# EAGLE design DataControlBoard-Teensy (EAGLE 9.4.2)

## Sheet 1 of 2
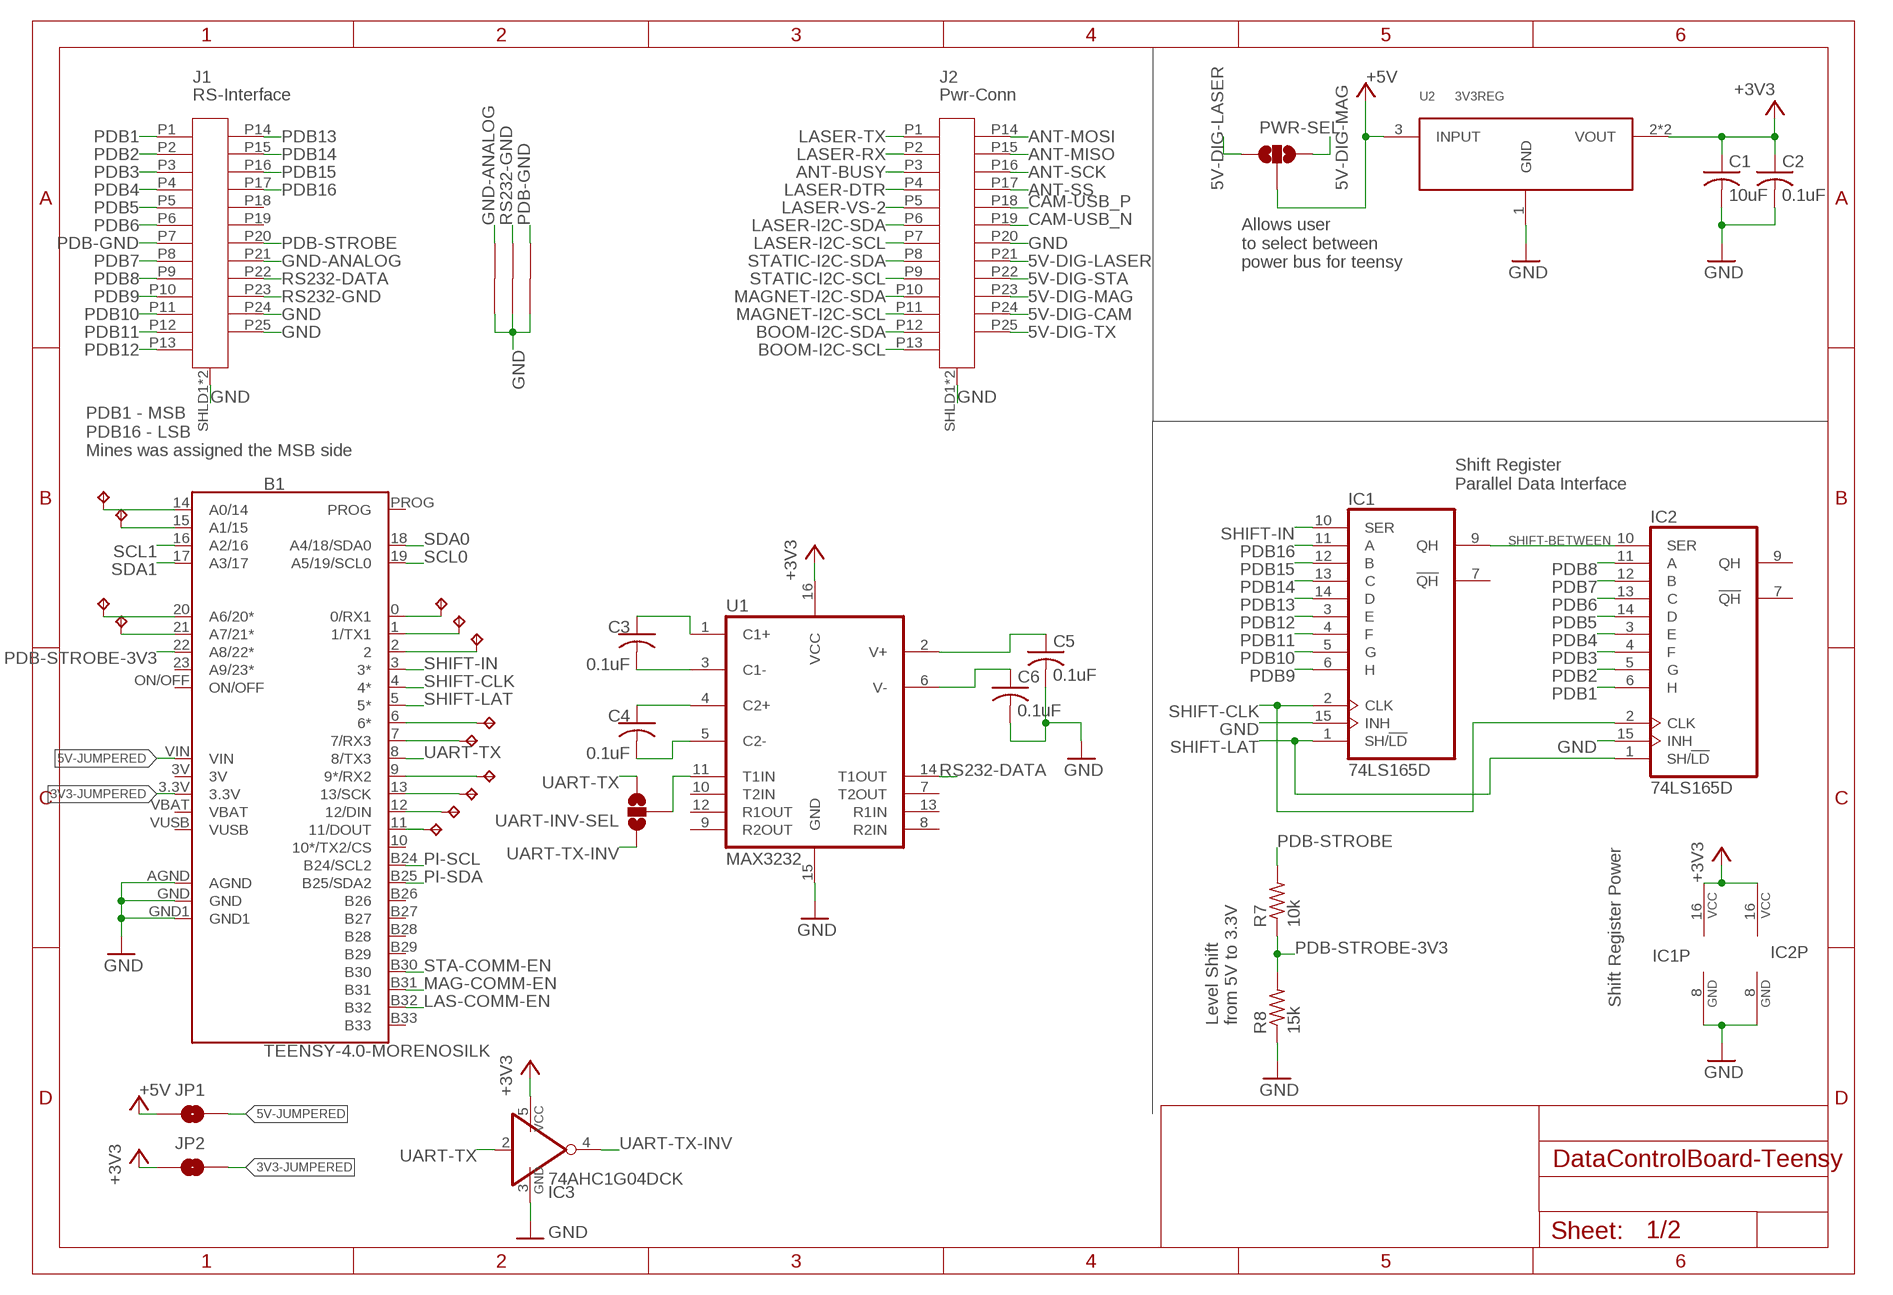
[diagram p0: schematic, sheet 1]

### Parts
B1  TEENSY-4.0-MORENOSILK  [TEENSY-4.0_NOSILK]
C1  10uF  C-USC0805  [C0805]
C2  0.1uF  C-USC0805  [C0805]
C3  0.1uF  C-USC0805  [C0805]
C4  0.1uF  C-USC0805  [C0805]
C5  0.1uF  C-USC0805  [C0805]
C6  0.1uF  C-USC0805  [C0805]
IC1  74LS165D  [SO16]
IC2  74LS165D  [SO16]
IC3  74AHC1G04DCK  [SC70-5]
J1  RS-Interface  MICRO-D25  [MICRO-D25-RA]
J2  Pwr-Conn  MICRO-D25  [MICRO-D25-RA]
JP1  JUMPER-SMT_2_NO_NO-SILK  [SMT-JUMPER_2_NO_NO-SILK]
JP2  JUMPER-SMT_2_NO_NO-SILK  [SMT-JUMPER_2_NO_NO-SILK]
PWR-SEL  JUMPER-SMT_3_NO_NO-SILK  [SMT-JUMPER_3_NO_NO-SILK]
R7  10k  R-US_R0805  [R0805]
R8  15k  R-US_R0805  [R0805]
TP8  TPPAD1-13  [P1-13]
TP9  TPPAD1-13  [P1-13]
TP10  TPPAD1-13  [P1-13]
TP11  TPPAD1-13  [P1-13]
TP12  TPPAD1-13  [P1-13]
TP13  TPPAD1-13  [P1-13]
TP14  TPPAD1-13  [P1-13]
TP15  TPPAD1-13  [P1-13]
TP16  TPPAD1-13  [P1-13]
TP17  TPPAD1-13  [P1-13]
TP18  TPPAD1-13  [P1-13]
TP19  TPPAD1-13  [P1-13]
TP20  TPPAD1-13  [P1-13]
U1  MAX3232  MAX2323SOIC16  [SO16]
U2  3V3REG  [SOT223]
U$1  GND-MERGER  [GND-MERGER]
U$2  GND-MERGER  [GND-MERGER]
U$3  GND-MERGER  [GND-MERGER]
UART-INV-SEL  JUMPER-SMT_3_NO_NO-SILK  [SMT-JUMPER_3_NO_NO-SILK]

### Nets
3V3-JUMPERED: B1.3.3V JP2.2
5V-DIG-CAM: J2.P24 ; also sheet 2
5V-DIG-LASER: J2.P21 PWR-SEL.1 ; also sheet 2
5V-DIG-MAG: J2.P23 PWR-SEL.3 ; also sheet 2
5V-DIG-STA: J2.P22 ; also sheet 2
5V-DIG-TX: J2.P25 ; also sheet 2
5V-JUMPERED: B1.VIN JP1.2
+3V3: C1.1 C2.1 IC1.16(VCC) IC2.16(VCC) IC3.5(VCC) JP2.1 U1.16(VCC) U2.2(VOUT) U2.4(VOUT) ; also sheet 2
+5V: JP1.1 PWR-SEL.2 U2.3(INPUT) ; also sheet 2
ANT-BUSY: J2.P3 ; also sheet 2
ANT-MISO: J2.P15 ; also sheet 2
ANT-MOSI: J2.P14 ; also sheet 2
ANT-SCK: J2.P16 ; also sheet 2
ANT-SS: J2.P17 ; also sheet 2
BOOM-I2C-SCL: J2.P13 ; also sheet 2
BOOM-I2C-SDA: J2.P12 ; also sheet 2
CAM-USB_N [USB-Diff]: J2.P19 ; also sheet 2
CAM-USB_P [USB-Diff]: J2.P18 ; also sheet 2
GND: B1.AGND B1.GND B1.GND1 C1.2 C2.2 C5.2 C6.2 IC1.8(GND) IC1.15(INH) IC2.8(GND) IC2.15(INH) IC3.3(GND) J1.P24 J1.P25 J1.SHLD1(SHLD) J1.SHLD2(SHLD) J2.P20 J2.SHLD1(SHLD) J2.SHLD2(SHLD) R8.1 U1.15(GND) U2.1(GND) U$1.P$1 U$2.P$1 U$3.P$1 ; also sheet 2
GND-ANALOG: J1.P21 U$1.P$2
LAS-COMM-EN: B1.B32 ; also sheet 2
LASER-DTR: J2.P4 ; also sheet 2
LASER-I2C-SCL: J2.P7 ; also sheet 2
LASER-I2C-SDA: J2.P6 ; also sheet 2
LASER-RX: J2.P2 ; also sheet 2
LASER-TX: J2.P1 ; also sheet 2
LASER-VS-2: J2.P5 ; also sheet 2
MAG-COMM-EN: B1.B31 ; also sheet 2
MAGNET-I2C-SCL: J2.P11 ; also sheet 2
MAGNET-I2C-SDA: J2.P10 ; also sheet 2
N$1: B1.0(0/RX1) TP12.TP
N$2: B1.1(1/TX1) TP13.TP
N$3: B1.2 TP14.TP
N$4: B1.9(9*/RX2) TP15.TP
N$5: B1.13(13/SCK) TP16.TP
N$7: B1.12(12/DIN) TP17.TP
N$8: B1.11(11/DOUT) TP18.TP
N$9: B1.14(A0/14) TP8.TP
N$10: B1.15(A1/15) TP9.TP
N$11: B1.20(A6/20*) TP10.TP
N$12: B1.21(A7/21*) TP11.TP
N$13: B1.6(6*) TP19.TP
N$14: B1.7(7/RX3) TP20.TP
N$20: U1.11(T1IN) UART-INV-SEL.2
N$32: C5.1 U1.2(V+)
N$33: C6.1 U1.6(V-)
N$34: C3.1 U1.1(C1+)
N$35: C3.2 U1.3(C1-)
N$36: C4.1 U1.4(C2+)
N$37: C4.2 U1.5(C2-)
PDB1: IC2.6(H) J1.P1
PDB2: IC2.5(G) J1.P2
PDB3: IC2.4(F) J1.P3
PDB4: IC2.3(E) J1.P4
PDB5: IC2.14(D) J1.P5
PDB6: IC2.13(C) J1.P6
PDB7: IC2.12(B) J1.P8
PDB8: IC2.11(A) J1.P9
PDB9: IC1.6(H) J1.P10
PDB10: IC1.5(G) J1.P11
PDB11: IC1.4(F) J1.P12
PDB12: IC1.3(E) J1.P13
PDB13: IC1.14(D) J1.P14
PDB14: IC1.13(C) J1.P15
PDB15: IC1.12(B) J1.P16
PDB16: IC1.11(A) J1.P17
PDB-GND: J1.P7 U$3.P$2
PDB-STROBE: J1.P20 R7.2 ; also sheet 2
PDB-STROBE-3V3: B1.22(A8/22*) R7.1 R8.2
PI-SCL: B1.B24(B24/SCL2) ; also sheet 2
PI-SDA: B1.B25(B25/SDA2) ; also sheet 2
RS232-DATA: J1.P22 U1.14(T1OUT)
RS232-GND: J1.P23 U$2.P$2
SCL0: B1.19(A5/19/SCL0) ; also sheet 2
SCL1: B1.16(A2/16) ; also sheet 2
SDA0: B1.18(A4/18/SDA0) ; also sheet 2
SDA1: B1.17(A3/17) ; also sheet 2
SHIFT-BETWEEN: IC1.9(QH) IC2.10(SER)
SHIFT-CLK: B1.4(4*) IC1.2(CLK) IC2.2(CLK)
SHIFT-IN: B1.3(3*) IC1.10(SER)
SHIFT-LAT: B1.5(5*) IC1.1(SH/!LD) IC2.1(SH/!LD)
STA-COMM-EN: B1.B30 ; also sheet 2
STATIC-I2C-SCL: J2.P9 ; also sheet 2
STATIC-I2C-SDA: J2.P8 ; also sheet 2
UART-TX: B1.8(8/TX3) IC3.2(I) UART-INV-SEL.3
UART-TX-INV: IC3.4(O) UART-INV-SEL.1
Unconnected: B1.10(10*/TX2/CS) B1.23(A9/23*) B1.B26 B1.B27 B1.B28 B1.B29 B1.B33 B1.ON/OFF B1.PROG IC1.7(!QH) IC2.7(!QH) IC2.9(QH) J1.P18 J1.P19 U1.7(T2OUT) U1.8(R2IN) U1.9(R2OUT) U1.10(T2IN) U1.12(R1OUT) U1.13(R1IN)

### Notes on the sheet
- Allows user
  to select between
  power bus for teensy
- PDB1 - MSB
  PDB16 - LSB 
  Mines was assigned the MSB side
- Shift Register
  Parallel Data Interface
- Shift Register Power
- Level Shift
  from 5V to 3.3V

## Sheet 2 of 2
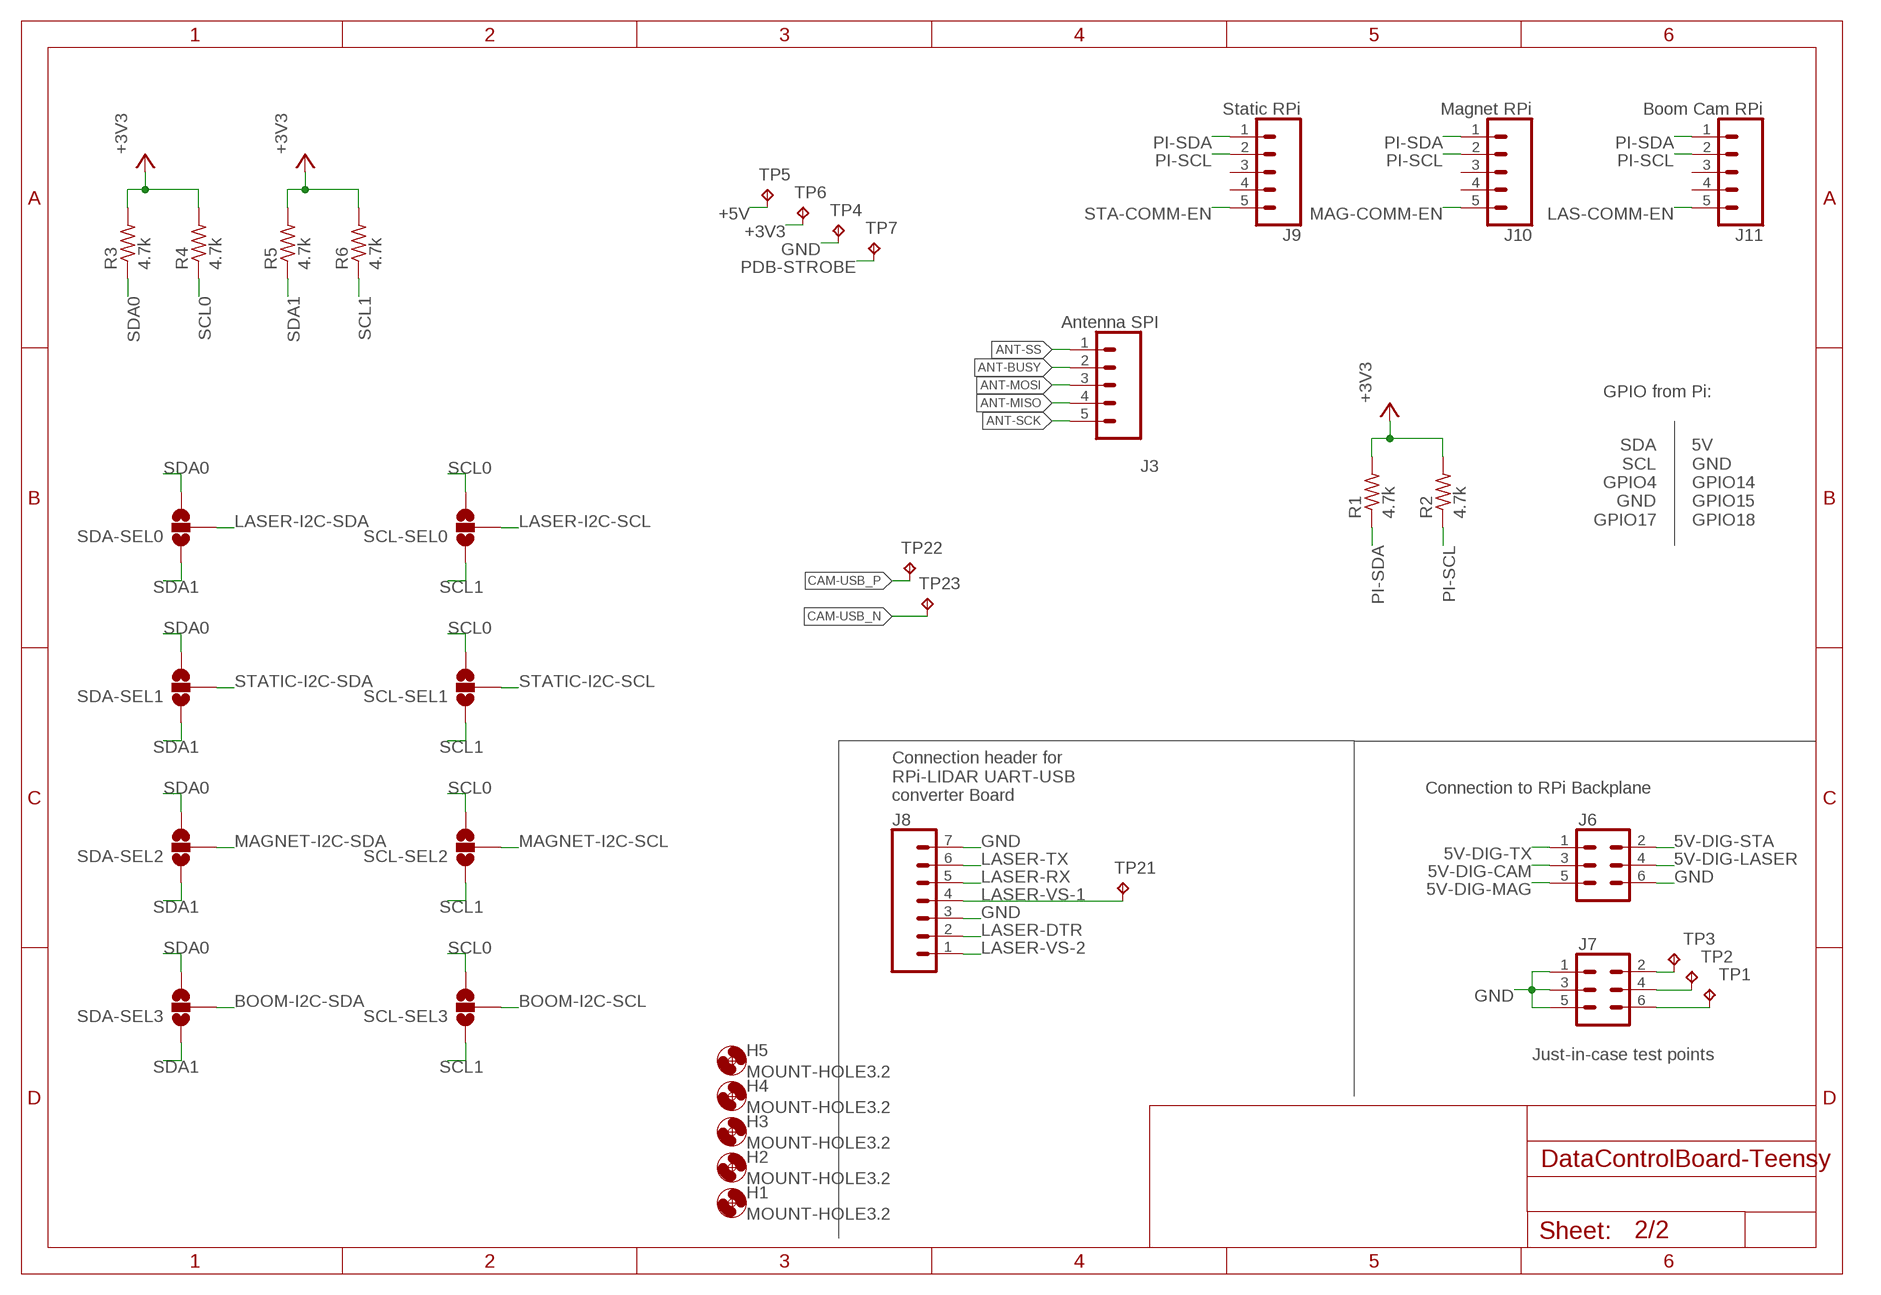
[diagram p1: schematic, sheet 2]

### Parts
H1  MOUNT-HOLE3.2  [3,2]
H2  MOUNT-HOLE3.2  [3,2]
H3  MOUNT-HOLE3.2  [3,2]
H4  MOUNT-HOLE3.2  [3,2]
H5  MOUNT-HOLE3.2  [3,2]
J3  Antenna SPI  CONN_05LOCK  [1X05_LOCK]
J6  CONN_03X22X3_SILK_MALE_PTH  [2X3]
J7  CONN_03X22X3_SILK_MALE_PTH  [2X3]
J8  CONN_07  [1X07]
J9  Static RPi  CONN_05LOCK  [1X05_LOCK]
J10  Magnet RPi  CONN_05LOCK  [1X05_LOCK]
J11  Boom Cam RPi  CONN_05LOCK  [1X05_LOCK]
R1  4.7k  R-US_R0805  [R0805]
R2  4.7k  R-US_R0805  [R0805]
R3  4.7k  R-US_R0805  [R0805]
R4  4.7k  R-US_R0805  [R0805]
R5  4.7k  R-US_R0805  [R0805]
R6  4.7k  R-US_R0805  [R0805]
SCL-SEL0  JUMPER-SMT_3_NO_NO-SILK  [SMT-JUMPER_3_NO_NO-SILK]
SCL-SEL1  JUMPER-SMT_3_NO_NO-SILK  [SMT-JUMPER_3_NO_NO-SILK]
SCL-SEL2  JUMPER-SMT_3_NO_NO-SILK  [SMT-JUMPER_3_NO_NO-SILK]
SCL-SEL3  JUMPER-SMT_3_NO_NO-SILK  [SMT-JUMPER_3_NO_NO-SILK]
SDA-SEL0  JUMPER-SMT_3_NO_NO-SILK  [SMT-JUMPER_3_NO_NO-SILK]
SDA-SEL1  JUMPER-SMT_3_NO_NO-SILK  [SMT-JUMPER_3_NO_NO-SILK]
SDA-SEL2  JUMPER-SMT_3_NO_NO-SILK  [SMT-JUMPER_3_NO_NO-SILK]
SDA-SEL3  JUMPER-SMT_3_NO_NO-SILK  [SMT-JUMPER_3_NO_NO-SILK]
TP1  TPPAD1-13  [P1-13]
TP2  TPPAD1-13  [P1-13]
TP3  TPPAD1-13  [P1-13]
TP4  GND  TPPAD1-13  [P1-13]
TP5  5V  TPPAD1-13  [P1-13]
TP6  3.3V  TPPAD1-13  [P1-13]
TP7  STROBE  TPPAD1-13  [P1-13]
TP21  TPPAD1-13  [P1-13]
TP22  TPPAD1-13  [P1-13]
TP23  TPPAD1-13  [P1-13]

### Nets
5V-DIG-CAM: J6.3 ; also sheet 1
5V-DIG-LASER: J6.4 ; also sheet 1
5V-DIG-MAG: J6.5 ; also sheet 1
5V-DIG-STA: J6.2 ; also sheet 1
5V-DIG-TX: J6.1 ; also sheet 1
+3V3: R1.2 R2.2 R3.2 R4.2 R5.2 R6.2 TP6.TP ; also sheet 1
+5V: TP5.TP ; also sheet 1
ANT-BUSY: J3.2 ; also sheet 1
ANT-MISO: J3.4 ; also sheet 1
ANT-MOSI: J3.3 ; also sheet 1
ANT-SCK: J3.5 ; also sheet 1
ANT-SS: J3.1 ; also sheet 1
BOOM-I2C-SCL: SCL-SEL3.2 ; also sheet 1
BOOM-I2C-SDA: SDA-SEL3.2 ; also sheet 1
CAM-USB_N [USB-Diff]: TP23.TP ; also sheet 1
CAM-USB_P [USB-Diff]: TP22.TP ; also sheet 1
GND: J6.6 J7.1 J7.3 J7.5 J8.3 J8.7 TP4.TP ; also sheet 1
LAS-COMM-EN: J11.5 ; also sheet 1
LASER-DTR: J8.2 ; also sheet 1
LASER-I2C-SCL: SCL-SEL0.2 ; also sheet 1
LASER-I2C-SDA: SDA-SEL0.2 ; also sheet 1
LASER-RX: J8.5 ; also sheet 1
LASER-TX: J8.6 ; also sheet 1
LASER-VS-1: J8.4 TP21.TP
LASER-VS-2: J8.1 ; also sheet 1
MAG-COMM-EN: J10.5 ; also sheet 1
MAGNET-I2C-SCL: SCL-SEL2.2 ; also sheet 1
MAGNET-I2C-SDA: SDA-SEL2.2 ; also sheet 1
N$6: J7.2 TP3.TP
N$27: J7.4 TP2.TP
N$28: J7.6 TP1.TP
PDB-STROBE: TP7.TP ; also sheet 1
PI-SCL: J9.2 J10.2 J11.2 R2.1 ; also sheet 1
PI-SDA: J9.1 J10.1 J11.1 R1.1 ; also sheet 1
SCL0: R4.1 SCL-SEL0.3 SCL-SEL1.3 SCL-SEL2.3 SCL-SEL3.3 ; also sheet 1
SCL1: R6.1 SCL-SEL0.1 SCL-SEL1.1 SCL-SEL2.1 SCL-SEL3.1 ; also sheet 1
SDA0: R3.1 SDA-SEL0.3 SDA-SEL1.3 SDA-SEL2.3 SDA-SEL3.3 ; also sheet 1
SDA1: R5.1 SDA-SEL0.1 SDA-SEL1.1 SDA-SEL2.1 SDA-SEL3.1 ; also sheet 1
STA-COMM-EN: J9.5 ; also sheet 1
STATIC-I2C-SCL: SCL-SEL1.2 ; also sheet 1
STATIC-I2C-SDA: SDA-SEL1.2 ; also sheet 1
Unconnected: J9.3 J9.4 J10.3 J10.4 J11.3 J11.4

### Notes on the sheet
- GPIO from Pi:
- SDA
  SCL
  GPIO4
  GND
  GPIO17
- 5V
  GND
  GPIO14
  GPIO15
  GPIO18
- Connection header for
  RPi-LIDAR UART-USB 
  converter Board
- Connection to RPi Backplane
- Just-in-case test points

## Power pins joined to a net without a drawn wire
3V: B1.3V
VBAT: B1.VBAT
VUSB: B1.VUSB

## Library data of the parts
B1 = RPi-Parts:TEENSY-4.0-MORE: Teensy 4.0 Footprint Mechanical footprint with connectors for Teensy Development Board with ARM Cortex. SparkFun Products: Teensy 4.0 <https://www.sparkfun.com/products/15583>; SF_ID: DEV-12646
C1-C6 = rcl:C-US: CAPACITOR, American symbol; SPICEPREFIX: C
H1-H5 = holes:MOUNT-HOLE: MOUNTING HOLE with drill center marker
IC1 IC2 = 74xx-us:74*165: 8-bit parallel load SHIFT REGISTER
IC3 = 74xx-little-de:74*1G04: INVERTER Gate
J1 J2 = RPi-Parts:MICRO-D25: Molex Micro-D25 pin connector, right angle, board mount WM14799-ND
J3 J9-J11 = SparkFun-Connectors:CONN_05: Multi connection point. Often used as Generic Header-pin footprint for 0.1 inch spaced/style header connections On any of the 0.1 inch spaced packages, you can populate with these: Break Away Headers - Straight <https://www.sparkfun.com/products/116> (PRT-00116) Break Away Male Headers - Right Angle <https://www.sparkfun.com/products/553> (PRT-00553) Female Headers <https://www.sparkfun.com/products/115> (PRT-00115) Break Away Headers - Machine Pin <https://www.sparkfun.com/products/117> (PRT-00117) Break Away Female Headers - Swiss Machine Pin <https://www.sparkfun.com/products/743> (PRT-00743) For SCREWTERMINALS and SPRING TERMINALS visit here: Screw Terimnals on SparkFun.com <https://www.sparkfun.com/search/results?term=Screw+Terminals> (5mm/3.5mm/2.54mm spacing) This device is also useful as a general connection point to wire up your design to another part of your project. Our various solder wires solder well into these plated through hole pads. Hook-Up Wire - Assortment (Stranded, 22 AWG) <https://www.sparkfun.com/products/11375> (PRT-11375) Hook-Up Wire - Assortment (Solid Core, 22 AWG) <https://www.sparkfun.com/products/11367> (PRT-11367) View the entire wire category on our website here <https://www.sparkfun.com/categories/141> Special notes: Molex polarized connector foot print use with SKU : PRT-08231 with associated crimp pins and housings. 1MM SMD Version SKU: PRT-10208
J6 J7 = SparkFun-Connectors:CONN_03X2: Multi connection point. Often used as Generic Header-pin footprint for 0.1 inch spaced/style header connections You can populate with any combo of single row headers, but if you'd like an exact match, check these: Header - 2x3 (Male, 0.1") <https://www.sparkfun.com/products/12807> (PRT-12807) Header - 2x3 (Female, 0.1") <https://www.sparkfun.com/products/13010> (PRT-13010) 2x3 Pin Shrouded Header <https://www.sparkfun.com/products/10877> (PRT-10877) On any of the 0.1 inch spaced packages, you can populate with these: Break Away Headers - Straight <https://www.sparkfun.com/products/116> (PRT-00116) Break Away Male Headers - Right Angle <https://www.sparkfun.com/products/553> (PRT-00553) Female Headers <https://www.sparkfun.com/products/115> (PRT-00115) Break Away Headers - Machine Pin <https://www.sparkfun.com/products/117> (PRT-00117) Break Away Female Headers - Swiss Machine Pin <https://www.sparkfun.com/products/743> (PRT-00743) Special note: the shrouded connector mates well with our 3x2 ribbon cables: Ribbon Crimp Connector - 6-pin (2x3, Female) <https://www.sparkfun.com/products/10651> (PRT-10651) Ribbon Cable - 6 wire (15ft) <https://www.sparkfun.com/products/10646> (PRT-10646); PROD_ID: CONN-09701
J8 = SparkFun-Connectors:CONN_07: Multi connection point. Often used as Generic Header-pin footprint for 0.1 inch spaced/style header connections On any of the 0.1 inch spaced packages, you can populate with these: Break Away Headers - Straight <https://www.sparkfun.com/products/116> (PRT-00116) Break Away Male Headers - Right Angle <https://www.sparkfun.com/products/553> (PRT-00553) Female Headers <https://www.sparkfun.com/products/115> (PRT-00115) Break Away Headers - Machine Pin <https://www.sparkfun.com/products/117> (PRT-00117) Break Away Female Headers - Swiss Machine Pin <https://www.sparkfun.com/products/743> (PRT-00743) For SCREWTERMINALS and SPRING TERMINALS visit here: Screw Terimnals on SparkFun.com <https://www.sparkfun.com/search/results?term=Screw+Terminals> (5mm/3.5mm/2.54mm spacing) This device is also useful as a general connection point to wire up your design to another part of your project. Our various solder wires solder well into these plated through hole pads. Hook-Up Wire - Assortment (Stranded, 22 AWG) <https://www.sparkfun.com/products/11375> (PRT-11375) Hook-Up Wire - Assortment (Solid Core, 22 AWG) <https://www.sparkfun.com/products/11367> (PRT-11367) View the entire wire category on our website here <https://www.sparkfun.com/categories/141> Special notes: Molex polarized connector foot print use with SKU : PRT-08231 with associated crimp pins and housings. 1MM SMD Version SKU: PRT-10208 NOTES ON THE VARIANTS LOCK and LOCK_LONGPADS... This footprint was designed to help hold the alignment of a through-hole component (i.e. 6-pin header) while soldering it into place. You may notice that each hole has been shifted either up or down by 0.005 of an inch from it's more standard position (which is a perfectly straight line). This slight alteration caused the pins (the squares in the middle) to touch the edges of the holes. Because they are alternating, it causes a "brace" to hold the component in place. 0.005 has proven to be the perfect amount of "off-center" position when using our standard breakaway headers. Although looks a little odd when you look at the bare footprint, once you have a header in there, the alteration is very hard to notice. Also,if you push a header all the way into place, it is covered up entirely on the bottom side.
JP1 JP2 = SparkFun-Jumpers:JUMPER-SMT_2_NO: Normally open jumper This jumper has two pads in close proximity to each other. Apply solder to close the connection. Round pads are easier to solder for beginners, but are a lot larger. SparkFun Product that uses the round pads: SparkFun EL Sequencer <https://www.sparkfun.com/products/12781>
PWR-SEL SCL-SEL0 SCL-SEL1-SCL-SEL3 SDA-SEL0 SDA-SEL1-SDA-SEL3 UART-INV-SEL = SparkFun-Jumpers:JUMPER-SMT_3_NO: Normally open jumper This jumper has three pads in close proximity to each other. Apply solder to close the connection(s).
R1-R8 = rcl:R-US_: RESISTOR, American symbol; SPICEPREFIX: R
TP1-TP23 = testpad:TP: Test pad
U1 = SparkFun-IC-Comms:MAX2323: RS232 Transceiver This part covers 232 drivers that are compatible with the MAX3232. Sipex SP3232EB Datasheet <http://cdn.sparkfun.com/datasheets/Components/General%20IC/SP3232EBCA-L.pdf> SparkFun Products SOIC component <https://www.sparkfun.com/products/589> (COM-00589 / IC-08171) Retired DIP component (COM-00316 / IC-08446) SparkFun Transceiver Breakout - MAX3232 <https://www.sparkfun.com/products/11189> (BOB-11189) SparkFun XBee Explorer Serial <https://www.sparkfun.com/products/13225> (WRL-13225); PROD_ID: IC-08171
U2 = PowerManagementParts:3V3REG: Diodes Inc. 800mA 3.3V cheap VREG AZ1117CH-3.3TRG1 AZ1117CH-3.3TRG1DICT-ND
U$1-U$3 = RPi-Parts:GND-MERGER

## Net classes
1 USB-Diff: width 0.254 mm, clearance 0.305 mm to class 0, clearance 0.152 mm

## Board
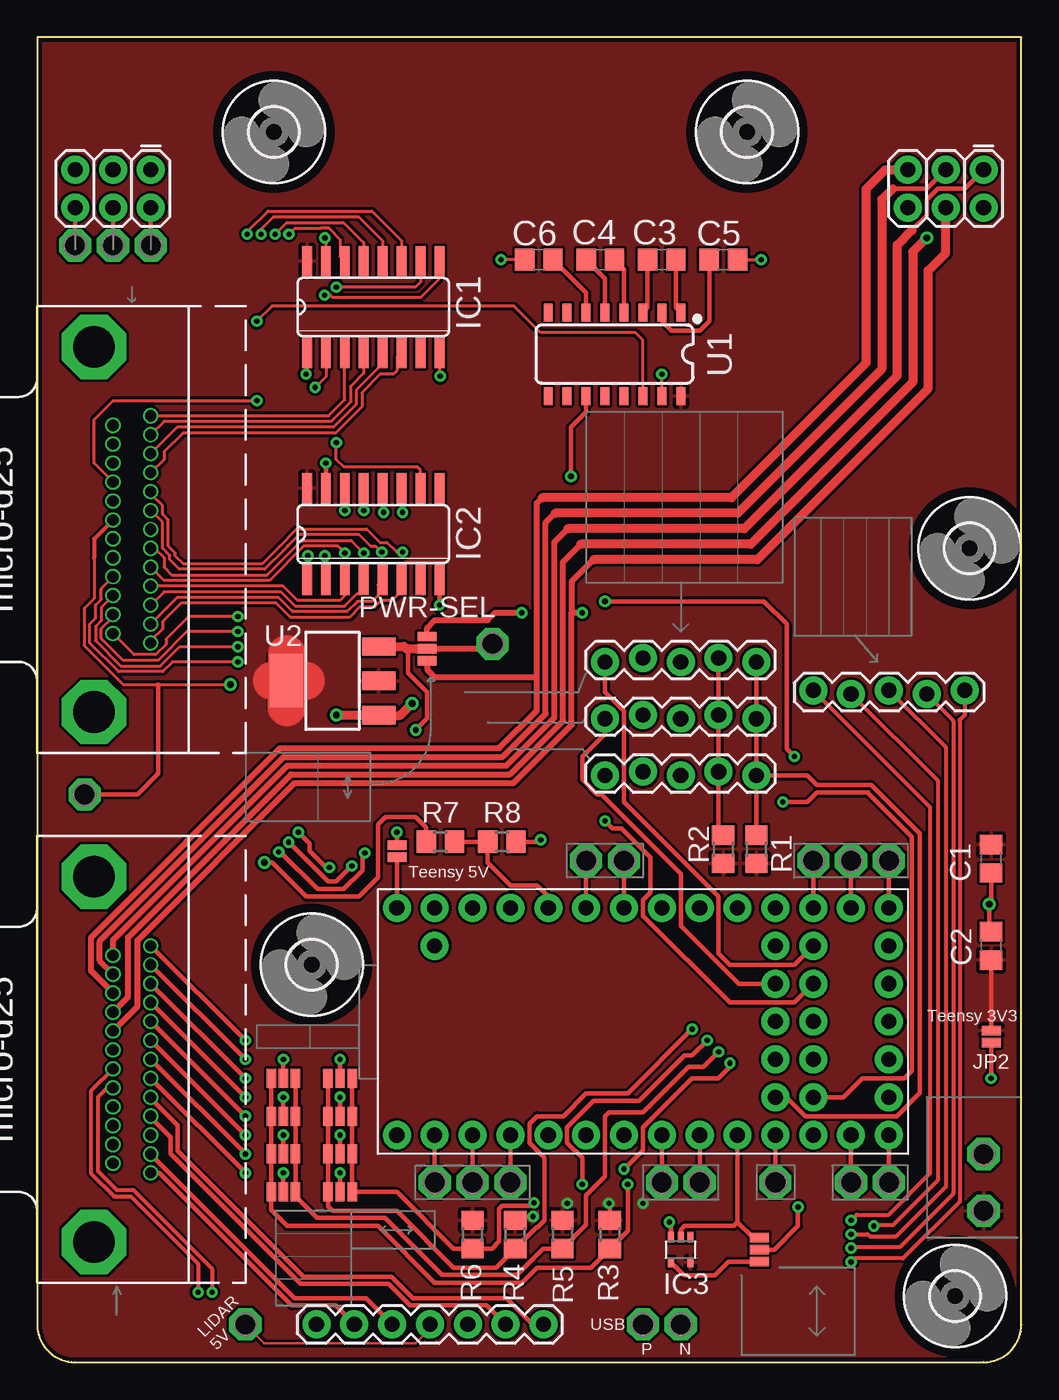
[diagram p2: board, top side]
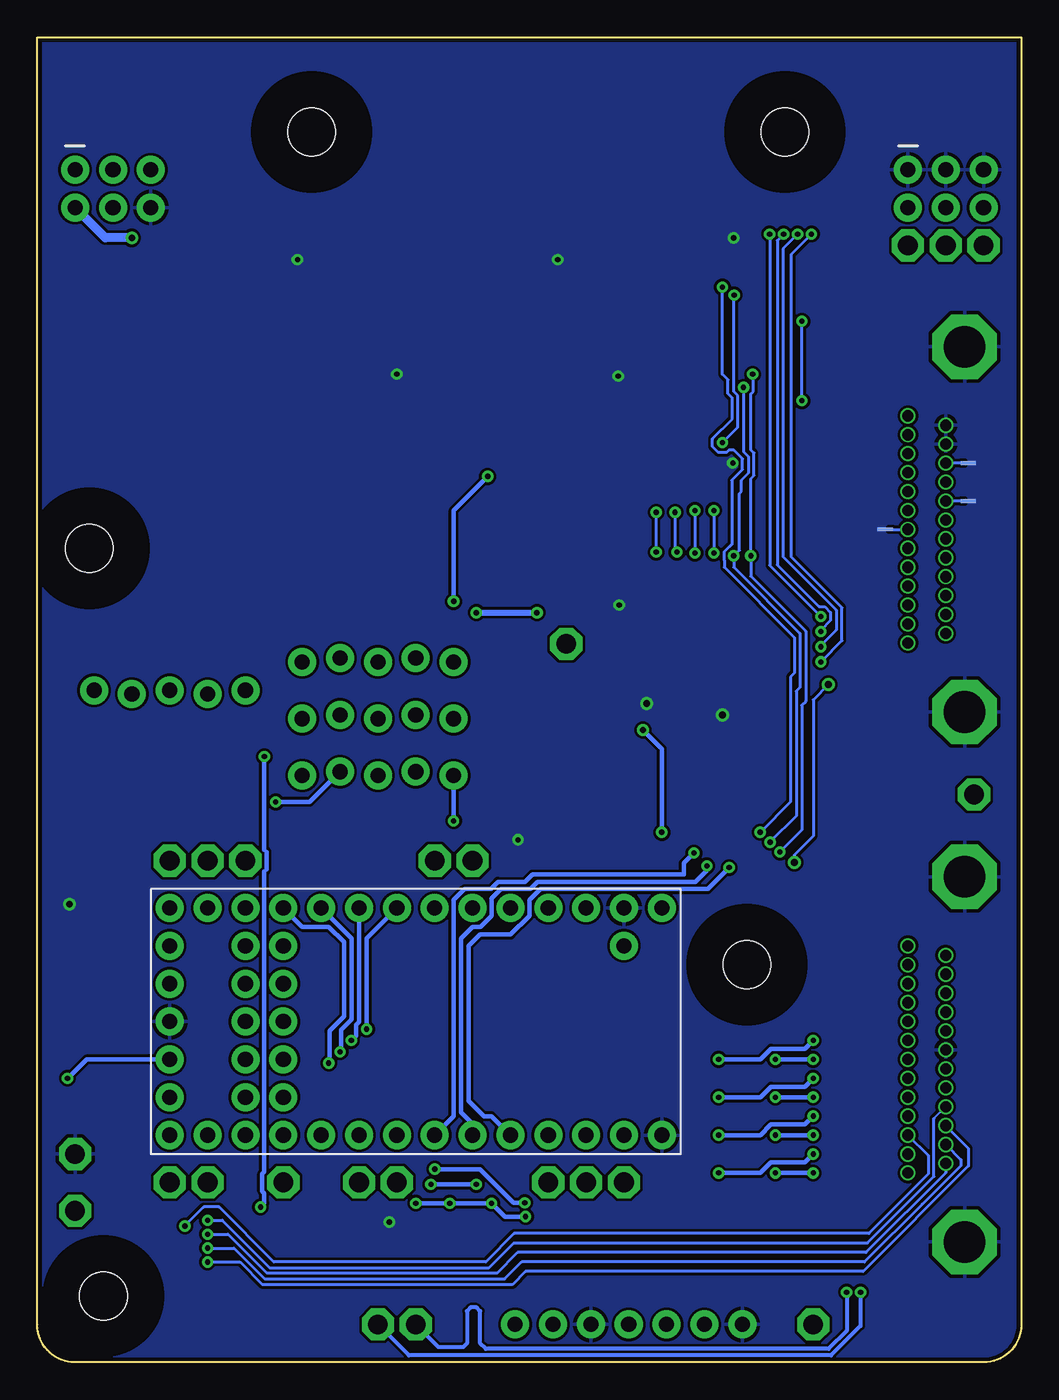
[diagram p3: board, bottom side, seen from below]

Size 66.04 x 88.9 mm. Coordinates in mm from the lower left corner, seen from the top.
Outline: 0,88.9 0,2.54 arc90 2.54,0 63.5,0 arc90 66.04,2.54 66.04,88.9 0,88.9
Copper layers (1*16): Top 0.0356mm / dielectric 1.5011mm / Bottom 0.0356mm
Design rules "PCBway": minimum track width 7mil, minimum drill 10mil, track to track 7mil, track to pad 7mil, pad to pad 7mil, via to via 7mil, smd to smd 0mil, copper to edge 10mil, drill to drill 10mil, minimum pad ring 4mil, minimum via ring 8mil, stop-mask expansion 4mil, vias tented up to drill 0mil, thermal gap 10mil

### Footprints (pad centres in the part's own frame; a part is rotated, then mirrored left to right if it is on the bottom)
TEENSY-4.0_NOSILK = drill 1.016 pad 1.88: 0 7.62,-13.97; 1 7.62,-11.43; 2 7.62,-8.89; 3 7.62,-6.35; 3.3V 2.54,16.51; 3V -7.62,-11.43; 4 7.62,-3.81; 5 7.62,-1.27; 6 7.62,1.27; 7 7.62,3.81; 8 7.62,6.35; 9 7.62,8.89; 10 7.62,11.43; 11 7.62,13.97; 12 7.62,16.51; 13 -7.62,16.51; 14 -7.62,13.97; 15 -7.62,11.43; 16 -7.62,8.89; 17 -7.62,6.35; 18 -7.62,3.81; 19 -7.62,1.27; 20 -7.62,-1.27; 21 -7.62,-3.81; 22 -7.62,-6.35; 23 -7.62,-8.89; AGND -7.62,-13.97; B24 5.08,11.43; B25 5.08,8.89; B26 2.54,11.43; B27 2.54,8.89; B28 0,11.43; B29 0,8.89; B30 -2.54,11.43; B31 -2.54,8.89; B32 -5.08,11.43; B33 -5.08,8.89; GND 0,16.51; GND1 7.62,-16.51; ON/OFF -5.08,16.51; PROG -2.54,16.51; VBAT 5.08,16.51; VIN -7.62,-16.51; VUSB -5.08,-13.97
C0805 = smd 1.3 x 1.5: 1 -0.95,0; 2 0.95,0
3,2 = hole 3.2: 0,0
SO16 = smd 0.66 x 2.032: 1 -4.445,-3.073; 2 -3.175,-3.073; 3 -1.905,-3.073; 4 -0.635,-3.073; 5 0.635,-3.073; 6 1.905,-3.073; 7 3.175,-3.073; 8 4.445,-3.073; 9 4.445,3.073; 10 3.175,3.073; 11 1.905,3.073; 12 0.635,3.073; 13 -0.635,3.073; 14 -1.905,3.073; 15 -3.175,3.073; 16 -4.445,3.073
SC70-5 = smd 0.4 x 0.7: 1 -0.65,-0.85; 2 0,-0.85; 3 0.65,-0.85; 4 0.65,0.85; 5 -0.65,0.85
MICRO-D25-RA = drill 0.75 pad 1.016: P1 -7.62,0; P2 -6.35,0; P3 -5.08,0; P4 -3.81,0; P5 -2.54,0; P6 -1.27,0; P7 0,0; P8 1.27,0; P9 2.54,0; P10 3.81,0; P11 5.08,0; P12 6.35,0; P13 7.62,0; P14 -6.985,2.54; P15 -5.715,2.54; P16 -4.445,2.54; P17 -3.175,2.54; P18 -1.905,2.54; P19 -0.635,2.54; P20 0.635,2.54; P21 1.905,2.54; P22 3.175,2.54; P23 4.445,2.54; P24 5.715,2.54; P25 6.985,2.54 | drill 2.794 pad 4.318 octagon: SHLD1 -12.255,3.81; SHLD2 12.255,3.81
1X05_LOCK = drill 1.016 pad 1.88: 1 0,0.127; 2 2.54,-0.127; 3 5.08,0.127; 4 7.62,-0.127; 5 10.16,0.127
2X3 = drill 1.016 pad 1.88: 1 0,0; 2 0,2.54; 3 2.54,0; 4 2.54,2.54; 5 5.08,0; 6 5.08,2.54
1X07 = drill 1.016 pad 1.88: 1 0,0; 2 2.54,0; 3 5.08,0; 4 7.62,0; 5 10.16,0; 6 12.7,0; 7 15.24,0
SMT-JUMPER_2_NO_NO-SILK = smd 0.635 x 1.27: 1 -0.406,0; 2 0.406,0
SMT-JUMPER_3_NO_NO-SILK = smd 0.635 x 1.27: 1 -0.813,0; 2 0,0; 3 0.813,0
R0805 = smd 1.3 x 1.5: 1 -0.95,0; 2 0.95,0
P1-13 = drill 1.321 pad 2.159 octagon: TP 0,0
SO16' = smd 0.6 x 1.2: 1 -4.445,-2.8; 2 -3.175,-2.8; 3 -1.905,-2.8; 4 -0.635,-2.8; 5 0.635,-2.8; 6 1.905,-2.8; 7 3.175,-2.8; 8 4.445,-2.8; 9 4.445,2.8; 10 3.175,2.8; 11 1.905,2.8; 12 0.635,2.8; 13 -0.635,2.8; 14 -1.905,2.8; 15 -3.175,2.8; 16 -4.445,2.8
SOT223 = smd 1.219 x 2.235: 1 -2.311,-3.099; 2 0,-3.099; 3 2.311,-3.099 | smd 3.6 x 2.2: 4 0,3.099
GND-MERGER = smd 0.762 x 0.254: P$1 -0.381,0 | smd 0.254 x 0.254: P$2 0.127,0

### Placement (x,y rotation side)
B1  40.64,22.86 270 top
C1  64.01,33.78 270 top
C2  64.01,27.94 90 top
C3  41.91,73.98 180 top
C4  37.78,73.98 180 top
C5  46.04,73.98 0 top
C6  33.66,73.98 180 top
H1  47.62,82.55 0 top
H2  15.88,82.55 0 top
H3  18.41,26.67 0 top
H4  61.59,4.45 0 top
H5  62.56,54.61 0 top
IC1  22.54,70.8 0 top
IC2  22.54,55.56 0 top
IC3  43.18,7.56 180 top
J1  7.62,55.88 90 top
J2  7.62,20.32 90 top
J3  52.07,44.96 0 top
J6  63.5,80.01 180 top
J7  7.62,80.01 180 top
J8  33.97,2.54 180 top
J9  48.26,39.5 180 top
J10  48.26,43.31 180 top
J11  48.26,47.12 180 top
JP1  24.13,34.29 270 top
JP2  64.01,21.84 270 top
PWR-SEL  26.16,47.88 270 top
R1  48.26,34.42 270 top
R2  46.04,34.42 270 top
R3  38.42,8.57 90 top
R4  32.07,8.57 90 top
R5  35.24,8.57 90 top
R6  29.21,8.57 90 top
R7  27.05,34.92 180 top
R8  31.18,34.92 180 top
SCL-SEL0  20.32,11.43 180 top
SCL-SEL1  20.32,13.97 180 top
SCL-SEL2  20.32,16.51 180 top
SCL-SEL3  20.32,19.05 180 top
SDA-SEL0  16.51,11.43 180 top
SDA-SEL1  16.51,13.97 180 top
SDA-SEL2  16.51,16.51 180 top
SDA-SEL3  16.51,19.05 180 top
TP1  2.54,74.93 180 top
TP2  5.08,74.93 180 top
TP3  7.62,74.93 180 top
TP4  63.5,13.97 90 top
TP5  30.54,48.2 90 top
TP6  63.5,10.16 90 top
TP7  3.17,38.1 90 top
TP8  54.61,33.66 180 top
TP9  52.07,33.66 180 top
TP10  39.37,33.66 180 top
TP11  36.83,33.66 180 top
TP12  26.67,12.06 180 top
TP13  29.21,12.06 180 top
TP14  31.75,12.06 180 top
TP15  49.53,12.06 180 top
TP16  57.15,33.66 180 top
TP17  57.15,12.06 180 top
TP18  54.61,12.06 180 top
TP19  41.91,12.06 0 top
TP20  44.45,12.06 0 top
TP21  13.97,2.54 0 top
TP22  40.64,2.54 0 top
TP23  43.18,2.54 0 top
U1  MAX3232  [SO16']  38.73,67.63 180 top
U2  19.81,45.72 90 top
U$1  3.81,57.78 180 bottom
U$2  3.81,60.33 180 bottom
U$3  8.89,55.88 0 bottom
UART-INV-SEL  48.45,7.56 90 top

### Tracks (layer width: path | path; a pad name or v marks a point on that pad's centre or on a via)
3V3-JUMPERED  (via drill 0.35)
  Top 0.305: v64.01,19.05 JP2.2
  Bottom 0.305: B1.3.3V 62.74,20.32 v64.01,19.05
5V-DIG-CAM
  Top 0.305: J6.3 59.69,78.74 57.4,78.74
  Top 0.406: J2.P24 4.19,26.94 4.19,28.26 16.55,40.62 31.23,40.62 34.11,43.5 34.11,56.33 34.75,56.97
  Top 0.61: 34.75,56.97 47.02,56.97 56.67,66.62 56.67,78 57.4,78.74
5V-DIG-LASER  (via drill 0.38)
  Top 0.406: J2.P21 6.73,23.88 6.73,28.31 17.29,38.86 31.96,38.86 35.87,42.77 35.87,50.29 | 37.34,53.85 35.87,52.38 35.87,50.29 | 35.87,50.29 v36.58,50.29 | v32.51,50.29 30.73,50.29 30.23,49.78 26.67,49.78 26.16,49.28 PWR-SEL.1
  Top 0.61: J6.4 60.96,74.42 59.79,73.25 59.79,65.33 48.31,53.85 37.34,53.85
  Bottom 0.406: v36.58,50.29 v32.51,50.29
5V-DIG-MAG
  Top 0.406: J2.P23 3.61,26.25 3.61,28.5 16.3,41.2 30.99,41.2 33.53,43.74 33.53,45.97 | 33.53,45.97 33.53,57.65 33.89,58.01 | PWR-SEL.3 26.16,46.48 26.67,45.97 33.53,45.97
  Top 0.61: J6.5 56.9,80.01 55.63,78.74 55.63,67.06 46.58,58.01 33.89,58.01
5V-DIG-STA  (via drill 0.45)
  Top 0.406: J2.P22 6.1,24.51 6.1,28.51 17.03,39.45 31.71,39.45 35.28,43.01 35.28,53.69 36.48,54.89
  Top 0.61: 36.48,54.89 47.88,54.89 58.75,65.76 58.75,74.5 v59.69,75.44
  Bottom 0.61: v59.69,75.44 61.47,75.44 J6.2
5V-DIG-TX
  Top 0.305: J6.1 62.23,78.74 60.43,78.74 59.69,78 59.69,76.94 58.69,75.95
  Top 0.406: J2.P25 5.08,28.32 16.79,40.03 31.47,40.03 34.7,43.26 34.7,55.01 35.61,55.93
  Top 0.61: 35.61,55.93 47.45,55.93 57.71,66.19 57.71,74.96 58.69,75.95
5V-JUMPERED
  Top 0.305: B1.VIN JP1.2
+3V3  (via drill 0.35)
  Top 0.305: R3.2 38.42,10.6 v38.35,10.67 | R4.2 32.31,9.77 v33.27,9.77 | C2.1 JP2.1
  Top 1.27: U2.4 16.51,45.92
  Top 2.54: U2.4 15.75,45.72 | U2.4 18.03,45.72 | U2.4 16.76,45.77 16.76,47.5 | U2.4 16.71,43.99 16.76,43.94
  Bottom 0.305: v33.27,9.77 34.66,9.77 v35.56,10.67 v38.35,10.67 v40.64,10.67
  pour Top: 0,88.9 0,0 66.04,0 66.04,88.9
+5V  (via drill 0.38)
  Top 0.305: JP1.1 v24.13,35.56 | v25.4,42.42 26.16,43.18 26.16,44.96 24.89,46.23 24.89,47.88
  Top 0.406: PWR-SEL.2 30.23,47.88 TP5.TP
  Top 0.61: U2.3 24.61,48.03 24.77,47.88 24.89,47.88 PWR-SEL.2
  Bottom 0.305: v24.13,35.56 24.13,41.15 v25.4,42.42
ANT-BUSY  (via drill 0.35)
  Top 0.254: J3.2 60.41,39.03 60.41,12.2 57.43,9.22 56.21,9.22 v56.13,9.14
  Bottom 0.203: J2.P3 6.25,13.87 6.25,12.62 10.24,8.64 34.04,8.64 35.94,6.73 50.16,6.73 53.85,10.41 54.86,10.41 v56.13,9.14
ANT-MISO  (via drill 0.35)
  Top 0.254: J3.4 61.47,43.05 61.47,11.31 57.88,7.72 54.67,7.72 v54.61,7.66
  Bottom 0.203: J2.P15 4.06,13.59 4.06,13.19 6.66,10.6 | 6.66,10.6 | 6.66,10.6 10.53,6.73 33.54,6.73 34.68,5.59 50.77,5.59 52.84,7.66 v54.61,7.66
ANT-MOSI  (via drill 0.35)
  Top 0.254: J3.3 60.96,41.27 60.96,11.78 57.65,8.46 55.85,8.46 55.72,8.59 v54.61,8.59
  Bottom 0.203: J2.P14 5.08,12.71 10.43,7.37 33.8,7.37 35.19,5.98 35.55,5.98 35.56,5.97 50.61,5.97 53.23,8.59 v54.61,8.59
ANT-SCK  (via drill 0.35)
  Top 0.254: J3.5 62.23,43.43 61.9,43.1 61.9,10.78 58.1,6.97 54.86,6.97 v54.61,6.72
  Bottom 0.203: J2.P16 3.56,14.35 3.56,13.16 10.62,6.1 33.27,6.1 34.16,5.21 50.93,5.21 52.44,6.72 v54.61,6.72
ANT-SS  (via drill 0.35)
  Top 0.254: J3.1 59.91,37.25 59.91,12.66 57.15,9.91 54.99,9.91 v54.61,9.53
  Bottom 0.178: 5.87,16.36 J2.P17
  Bottom 0.203: 5.87,16.36 5.87,12.47 10.33,8 34.06,8 35.71,6.35 50.45,6.35 53.63,9.53 v54.61,9.53
BOOM-I2C-SCL  (via drill 0.35)
  Top 0.305: SCL-SEL3.2 v20.32,20.32 | v13.97,21.59 J2.P13
  Bottom 0.305: v20.32,20.32 17.51,20.32 16.8,21.03 14.53,21.03 v13.97,21.59
BOOM-I2C-SDA  (via drill 0.35)
  Top 0.305: SDA-SEL3.2 v16.51,20.32 | v13.97,20.32 J2.P12
  Bottom 0.305: v16.51,20.32 v13.97,20.32
CAM-USB_N  (via drill 0.35)
  Top 0.254: J2.P19 3.63,18.24 3.63,12.65 5.16,11.12 6.27,11.12 10.79,6.6 v10.79,4.7
  Bottom 0.254: v10.79,4.7 10.79,2.44 12.78,0.46 41.1,0.46 TP23.TP
CAM-USB_P  (via drill 0.35)
  Top 0.254: J2.P18 4.7,18.41 4.06,17.78 4.06,12.83 5.33,11.56 6.45,11.56 11.73,6.28 v11.73,4.7
  Bottom 0.254: v11.73,4.7 11.73,2.11 12.95,0.89 35.94,0.89 36.32,1.27 36.32,3.43 36.58,3.68 36.96,3.68 37.21,3.43 37.21,1.27 37.47,1.02 39.12,1.02 TP22.TP
GND  (via drill 0.35, 0.45)
  Top 0.203: C5.2 v48.58,73.98 | C6.2 v31.11,73.98 | IC1.8 26.99,66.23 v27.05,66.17 | IC1.15 19.37,75.37 v19.3,75.44 | U1.15 v41.91,66.29
  Top 0.305: IC2.8 v26.99,50.8 | IC2.15 v19.37,60.33 | R8.1 33.66,34.92 v33.78,35.05 | IC3.3 42.53,9.29 v42.42,9.4 | C2.2 63.88,29.02 v63.88,30.73 64.01,30.86 C1.2
  Top 0.61: v25.15,44.2 24.36,43.41 U2.1 20.09,43.41 v20.07,43.43
  pour Bottom: 0,88.9 0,0 66.04,0 66.04,88.9
GND-ANALOG
  Bottom 0.203: U$1.P$2 J1.P21
LAS-COMM-EN
  Top 0.305: J11.5 38.1,44.98 39.37,43.71 39.37,37.59 45.72,31.24 45.72,27.43 46.48,26.67 50.8,26.67 B1.B32
LASER-DTR
  Top 0.305: J8.2 30.16,3.81 25.02,3.81 23.57,5.26 17.68,5.26 8.94,14 8.94,15.11 7.62,16.43 J2.P4
LASER-I2C-SCL  (via drill 0.35)
  Top 0.305: SCL-SEL0.2 v20.32,12.7 | v13.97,13.97 J2.P7
  Bottom 0.305: v13.97,13.97 14.53,13.41 16.8,13.41 17.51,12.7 v20.32,12.7
LASER-I2C-SDA  (via drill 0.35)
  Top 0.305: SDA-SEL0.2 v16.51,12.7 | J2.P6 v13.97,12.7
  Bottom 0.305: v16.51,12.7 v13.97,12.7
LASER-RX
  Top 0.305: J8.5 22.06,4.29 17.28,4.29 7.62,13.95 J2.P2
LASER-TX
  Top 0.305: J8.6 20,3.81 17.08,3.81 8.19,12.7 J2.P1
LASER-VS-1
  Top 0.178: TP21.TP 15.24,1.27 25.4,1.27 26.35,2.22 J8.4
LASER-VS-2
  Top 0.305: J8.1 33.23,2.54 31.48,4.29 25.22,4.29 23.77,5.74 17.88,5.74 9.42,14.2 9.42,15.89 7.62,17.7 J2.P5
MAG-COMM-EN
  Top 0.305: J10.5 38.1,42.16 36.58,40.64 36.58,39.1 37.57,38.1 37.85,38.1 43.18,32.77 43.18,29.29 47.07,25.4 B1.B31
MAGNET-I2C-SCL  (via drill 0.35)
  Top 0.305: SCL-SEL2.2 v20.32,17.78 | v13.97,19.05 J2.P11
  Bottom 0.305: v20.32,17.78 17.51,17.78 16.8,18.49 14.53,18.49 v13.97,19.05
MAGNET-I2C-SDA  (via drill 0.35)
  Top 0.305: SDA-SEL2.2 v16.51,17.78 | v13.97,17.78 J2.P10
  Bottom 0.305: v16.51,17.78 v13.97,17.78
N$1
  Top 0.305: B1.0 TP12.TP
N$2
  Top 0.305: B1.1 TP13.TP
N$3
  Top 0.305: B1.2 TP14.TP
N$4
  Top 0.305: B1.9 TP15.TP
N$5
  Top 0.305: B1.13 TP16.TP
N$6
  Top 0.305: TP3.TP J7.2
N$7
  Top 0.305: B1.12 TP17.TP
N$8
  Top 0.305: B1.11 TP18.TP
N$9
  Top 0.305: B1.14 TP8.TP
N$10
  Top 0.305: B1.15 TP9.TP
N$11
  Top 0.305: B1.20 TP10.TP
N$12
  Top 0.305: B1.21 TP11.TP
N$13
  Top 0.305: B1.6 TP19.TP
N$14
  Top 0.305: B1.7 TP20.TP
N$20  (via drill 0.35, 0.38)
  Top 0.305: UART-INV-SEL.2 49.47,7.56 51.05,9.14 v51.05,10.41 | U1.11 36.83,63.75 35.81,62.74 v35.81,59.44 | v50.8,40.64 50.29,41.15 50.29,49.53 48.77,51.05 v38.1,51.05
  Bottom 0.305: v51.05,10.41 50.8,10.67 50.8,11.34 50.94,11.48 50.94,12.65 50.8,12.79 50.8,32.93 50.66,33.07 50.66,34.24 50.8,34.38 v50.8,40.64 | v38.1,51.05 38.1,57.15 v35.81,59.44
N$27
  Top 0.305: TP2.TP J7.4
N$28
  Top 0.305: TP1.TP J7.6
N$32
  Top 0.305: C5.1 45.09,69.85 44.45,69.22 42.55,69.22 41.91,69.85 U1.2
N$33
  Top 0.305: C6.1 36.83,71.75 U1.6
N$34
  Top 0.305: C3.1 42.86,70.75 U1.1
N$35
  Top 0.305: C3.2 40.96,70.75 U1.3
N$36
  Top 0.305: C4.1 39.37,73.34 U1.4
N$37
  Top 0.305: C4.2 38.1,72.71 U1.5
PDB1
  Top 0.203: IC2.6 24.45,51.75 23.81,51.12 23.08,51.12 22.64,50.67 21.64,50.67 20.94,49.97 16.99,49.97 16.04,50.93 9.65,50.93 8.41,49.68 8.41,49.2 7.62,48.42 J1.P1
PDB2
  Top 0.203: IC2.5 22.86,52.17 22.86,51.44 22.48,51.05 21.48,51.05 20.78,50.35 17.15,50.35 16.19,51.31 9.4,51.31 J1.P2
PDB3
  Top 0.203: J1.P3 8.51,51.69 16.35,51.69 17.3,50.74 20.63,50.74 21.45,51.56 21.84,51.56 21.91,51.63 IC2.4
PDB4
  Top 0.203: IC2.3 20.64,51.44 20.32,51.12 17.46,51.12 16.51,52.07 J1.P4
PDB5  (via drill 0.35)
  Top 0.203: J1.P5 8.51,52.45 15.58,52.45 17.89,54.76 20.17,54.76 v20.64,54.29 | IC2.14 v20.64,57.15
  Bottom 0.203: v20.64,57.15 v20.64,54.29
PDB6  (via drill 0.35)
  Top 0.203: IC2.13 v21.91,57.15 | J1.P6 7.87,54.61 8.51,53.98 8.51,53.34 9.02,52.83 15.42,52.83 17.73,55.14 21.06,55.14 v21.91,54.29
  Bottom 0.203: v21.91,57.15 v21.91,54.29
PDB7  (via drill 0.35)
  Top 0.203: IC2.12 23.18,57.09 v23.24,57.02 | v23.11,54.36 22.73,54.74 22.39,54.74 21.61,55.52 17.57,55.52 16.84,54.79 16.73,54.67 16.52,54.47 15.26,53.21 9.53,53.21 8.89,53.85 8.89,54.13 8.41,54.62 8.41,56.36 J1.P8
  Bottom 0.203: v23.24,57.02 23.24,54.48 v23.11,54.36
PDB8  (via drill 0.35)
  Top 0.203: IC2.11 24.45,57.09 v24.51,57.02 | v24.51,54.36 24.13,54.36 23.47,55.01 23,55.01 22.11,55.9 17.41,55.9 16.25,54.74 15.11,53.59 9.78,53.59 9.27,54.1 9.27,54.29 8.79,54.77 8.79,56.52 8.41,56.9 8.41,57.48 7.62,58.26 J1.P9
  Bottom 0.203: v24.51,57.02 v24.51,54.36
PDB9
  Top 0.203: IC1.6 24.13,67.41 24.13,66.55 23.88,66.29 23.02,66.29 21.78,65.06 21.78,64.11 20.03,62.36 9.78,62.36 8.51,61.09 8.51,60.58 J1.P10
PDB10
  Top 0.203: IC1.5 23.18,66.99 21.4,65.22 21.4,64.26 19.87,62.74 9.4,62.74 J1.P11
PDB11
  Top 0.203: IC1.4 21.91,66.36 21.02,65.47 21.02,64.42 19.72,63.12 8.51,63.12 J1.P12
PDB12
  Top 0.203: J1.P13 19.56,63.5 20.64,64.58 IC1.3
PDB13  (via drill 0.35)
  Top 0.203: IC1.14 20.32,74.19 20.32,75.35 20.3,75.35 19.96,75.69 19.96,75.71 19.58,76.1 19.56,76.1 19.03,76.1 19.01,76.07 17.27,76.07 v16.89,75.69 | v13.46,50.04 10.16,50.04 8.64,48.51 8.64,48.16 7.95,47.47 6.5,47.47 J1.P14
  Bottom 0.203: v16.89,75.69 16.89,53.47 v13.46,50.04
PDB14  (via drill 0.35)
  Top 0.203: v13.46,49.02 10.03,49.02 8.1,47.09 5.77,47.09 4.29,48.57 4.29,49.22 5.08,50.01 J1.P15 | v15.96,75.69 16.74,76.48 20.55,76.48 21.91,75.12 IC1.13
  Bottom 0.203: v13.46,49.02 13.46,49.11 12.8,49.77 12.8,50.31 13.19,50.7 13.58,50.7 16.38,53.5 16.38,75.27 v15.96,75.69
PDB15  (via drill 0.35)
  Top 0.203: J1.P16 4.29,50.65 4.29,49.76 3.91,49.38 3.91,48.41 5.61,46.71 8.26,46.71 9.56,48.01 v13.46,48.01 | v15.02,75.69 15.02,76.02 15.86,76.86 21.57,76.86 23.18,75.25 IC1.12
  Bottom 0.203: v13.46,48.01 13.46,48.09 12.42,49.13 12.42,50.47 16,54.05 16,74.71 v15.02,75.69
PDB16  (via drill 0.35)
  Top 0.203: J1.P17 4.29,51.92 4.29,51.19 3.91,50.8 3.91,49.92 3.53,49.54 3.53,48.25 5.45,46.33 8.42,46.33 9.08,46.99 v13.46,46.99 | v14.09,75.69 14.09,75.85 15.48,77.24 22.46,77.24 24.45,75.25 IC1.11
  Bottom 0.203: v13.46,46.99 12.04,48.41 12.04,50.63 15.44,54.03 15.44,74.34 v14.09,75.69
PDB-GND
  Bottom 0.203: U$3.P$2 J1.P7
PDB-STROBE  (via drill 0.45)
  Top 0.203: 3.81,53.98 3.81,51.24 3.15,50.58 3.15,48.09 5.78,45.47 8.13,45.47 v12.95,45.47
  Top 0.254: J1.P20 3.81,55.24 3.81,53.98
  Top 0.305: v15.24,33.53 15.75,33.53 18.03,31.24 21.59,31.24 22.86,32.51 22.86,36.07 23.37,36.58 25.4,36.58 26.1,35.88 R7.2 | 8.13,45.47 8.13,39.5 6.73,38.1 TP7.TP
  Bottom 0.203: v12.95,45.47 13.97,44.45 13.97,35.31 15.24,34.04 v15.24,33.53
PDB-STROBE-3V3
  Top 0.305: R7.1 R8.2 30.23,33.53 31.75,32 33.53,32 34.29,31.24 B1.22
PI-SCL  (via drill 0.35)
  Top 0.305: J11.2 J10.2 J9.2 45.72,35.68 R2.1 | v50.04,37.59 51.69,37.59 52.32,38.23 55.75,38.23 55.75,38.17 58.67,35.25 58.67,19.54 58.18,19.05 55.37,19.05 54.1,17.78 B1.B24
  Bottom 0.305: J9.2 47.75,37.59 v50.04,37.59
PI-SDA
  Top 0.305: J11.1 J10.1 J9.1 | J9.1 R1.1 | J9.1 51.69,39.37 52.32,38.73 55.96,38.73 59.22,35.48 59.22,18.06 57.68,16.51 51.54,16.51 50.27,17.78 B1.B25
RS232-DATA  (via drill 0.35)
  Top 0.203: J1.P22 3.81,60.33 3.81,63.25 5.08,64.52 v14.73,64.52 | v14.73,69.85 15.75,70.87 32,70.87 33.78,69.09 40.13,69.09 40.64,68.58 U1.14
  Bottom 0.203: v14.73,64.52 v14.73,69.85
RS232-GND
  Bottom 0.203: U$2.P$2 J1.P23
SCL0  (via drill 0.35)
  Top 0.305: SCL-SEL3.3 SCL-SEL2.3 SCL-SEL1.3 SCL-SEL0.3 19.51,10.46 19.81,10.16 24.13,10.16 27.94,6.35 30.8,6.35 R4.1 33.51,9.06 33.57,9.06 34.04,9.53 34.04,13.7 33.02,14.71 33.02,16 33.53,16.51 35.31,16.51 36.83,18.03 39.62,18.03 v43.94,22.35
  Bottom 0.305: B1.19 43.94,28.45 v43.94,22.35
SCL1  (via drill 0.35)
  Top 0.305: SCL-SEL3.1 SCL-SEL2.1 SCL-SEL1.1 SCL-SEL0.1 24.13,11.43 27.94,7.62 R6.1 30.5,7.62 30.99,8.11 30.99,10.31 31.18,10.5 33.13,10.5 v33.33,10.7 | v46.48,20.07 46.48,19.81 45.72,19.05 43.92,19.05 40.64,15.77 40.64,14.22 v39.37,12.95
  Bottom 0.305: B1.16 48.26,29.21 46.48,29.21 45.47,28.19 45.47,23.2 46.43,22.23 46.43,20.12 v46.48,20.07 | v33.33,10.7 34.07,10.7 36.32,12.95 v39.37,12.95
SDA0  (via drill 0.35)
  Top 0.305: SDA-SEL3.3 SDA-SEL2.3 SDA-SEL1.3 SDA-SEL0.3 15.7,10.21 16.76,9.14 22.86,9.14 26.67,5.33 32.51,5.33 33.53,6.35 37.15,6.35 R3.1 39.62,8.83 v39.62,11.94 | v36.58,11.94 36.58,13.7 35.56,14.71 35.56,15.77 37.32,17.53 40.39,17.53 43.43,20.57 43.94,20.57 v44.96,21.59
  Bottom 0.305: v44.96,21.59 44.65,21.9 44.65,22.64 44.45,22.85 B1.18 | v39.62,11.94 v36.58,11.94
SDA1  (via drill 0.35)
  Top 0.305: SDA-SEL3.1 SDA-SEL2.1 SDA-SEL1.1 SDA-SEL0.1 17.42,11.33 17.42,11.02 18.77,9.68 23.34,9.68 27.15,5.87 32.18,5.87 33.93,7.62 R5.1 36.83,9.21 36.83,11.19 38.1,12.46 38.1,16.51 38.35,16.76 40.64,16.76 43.69,19.81 44.7,19.81 v45.72,20.83
  Bottom 0.305: v45.72,20.83 45.67,20.88 45.67,22.31 44.96,23.02 44.96,28.45 B1.17
SHIFT-BETWEEN  (via drill 0.35)
  Top 0.203: IC2.10 25.72,59.88 25.53,60.07 20.57,60.07 20.07,60.58 v20.07,61.7 | v19.28,71.6 19.67,71.6 19.79,71.48 25.76,71.48 26.99,72.71 IC1.9
  Bottom 0.203: v20.07,61.7 19.03,62.74 19.03,64.86 19.3,65.13 19.3,71.58 v19.28,71.6
SHIFT-CLK  (via drill 0.35)
  Top 0.203: v19.3,54.1 19.3,52.55 IC2.2 | IC1.2 19.37,66.13 v18.65,65.41
  Top 0.305: v16.86,34.9 19.51,32.26 20.07,32.26 v21.11,33.3
  Bottom 0.203: v18.65,65.41 18.65,61.09 18.33,60.78 18.33,59.65 18.8,59.18 18.8,58.42 18.92,58.29 18.92,54.48 v19.3,54.1 19.3,53.34 14.86,48.9 14.86,45.29 15.11,45.03 15.11,36.65 v16.86,34.9
  Bottom 0.305: B1.4 36.83,16 37.59,16.76 37.59,28.45 36.83,29.21 36.3,29.21 35.56,29.95 35.56,31.11 34.92,31.75 32.96,31.75 32.48,32.23 21.87,32.23 21.11,32.99 v21.11,33.3
SHIFT-IN  (via drill 0.35)
  Top 0.203: IC1.10 25.72,72.45 25.4,72.14 v20.07,72.14
  Top 0.305: v19.61,33.19 19.38,33.19 18.29,34.29 18.29,34.8 v17.53,35.56
  Bottom 0.203: v20.07,72.14 20.07,66.29 19.68,65.91 19.68,64.97 19.41,64.7 19.41,63.29 20.72,61.97 20.72,61.43 20.34,61.04 19.79,61.04 19.62,61.21 19.3,61.21 18.71,60.62 18.71,59.9 19.43,59.18 19.43,54.86 19.54,54.76 19.58,54.76 19.96,54.37 19.96,53.83 19.94,53.81 19.94,53.34 15.24,48.64 15.24,46.23 15.49,45.97 15.49,37.59 v17.53,35.56
  Bottom 0.305: B1.3 35.56,16.51 36.07,16.51 37.08,17.53 37.08,27.94 36.32,28.7 34.27,28.7 33.02,29.95 33.02,31.01 32.28,31.75 21.05,31.75 v19.61,33.19
SHIFT-LAT  (via drill 0.35)
  Top 0.203: IC2.1 18.1,54.04 v18.16,54.1 | IC1.1 18.1,66.36 v18.03,66.29
  Top 0.305: v21.98,34.17 21.82,34.01 21.82,33.01 20.56,31.75 18.8,31.75 16.31,34.24 v16.2,34.24
  Bottom 0.203: v18.03,66.29 17.99,66.25 17.99,65.13 18.16,64.96 18.16,61.21 17.95,61 17.95,59.49 18.16,59.28 v18.16,54.1 18.16,52.74 14.48,49.05 14.48,44.35 14.73,44.09 14.73,35.71 v16.2,34.24
  Bottom 0.305: B1.5 38.1,16.51 38.1,31.01 37.36,31.75 35.61,31.75 35.12,32.23 33.3,32.23 32.82,32.72 22.66,32.72 22.66,33.49 v21.98,34.17
STA-COMM-EN  (via drill 0.35)
  Top 0.305: v38.1,36.32 38.61,35.81 39.2,35.81 41.15,33.87 41.15,31.51 40.64,31.01 40.64,29.95 46.46,24.13 50.8,24.13 B1.B30
  Bottom 0.305: J9.5 v38.1,36.32
STATIC-I2C-SCL  (via drill 0.35)
  Top 0.305: SCL-SEL1.2 v20.32,15.24 | J2.P9 v13.97,16.51
  Bottom 0.305: v20.32,15.24 17.51,15.24 16.8,15.95 14.53,15.95 v13.97,16.51
STATIC-I2C-SDA  (via drill 0.35)
  Top 0.305: SDA-SEL1.2 v16.51,15.24 | J2.P8 v13.97,15.24
  Bottom 0.305: v16.51,15.24 v13.97,15.24
UART-TX
  Top 0.305: 46.99,9.4 48.02,8.37 UART-INV-SEL.3 | B1.8 46.99,9.4 | 46.99,9.4 46.74,9.14 43.43,9.14 43.18,8.89 IC3.2
UART-TX-INV
  Top 0.305: IC3.4 43.4,5.84 45.47,5.84 46.37,6.74 UART-INV-SEL.1

### Text on the board
tNames: Teensy 5V | Teensy 3V3 | USB | LIDAR / 5V | P | N
tDocu: Data Control Board (Teensy) / Mines RockSat-X 2019 / Mark Gilliland, Graham Braly | REV 2.0 | 1 2 3 | RockSat Data I/F | 2 -SDA / 3 -SCL / 4 -NC / GND-NC / 17 -En | x3 | 5v | 17 -SS / 24 -BUSY / 10 -MOSI / 9 -MISO / 11 -SCK | BoomCam / Magnet / Static | Power / Source / Select | LSR / / MAG | Strobe | SDA SCL | GND | 3.3V | 0 1 | Boom / Magnet / Static / Laser | RS232 / Polarity | Norm / / / Invrt | Power / Board I/F
tplace-old: RPi